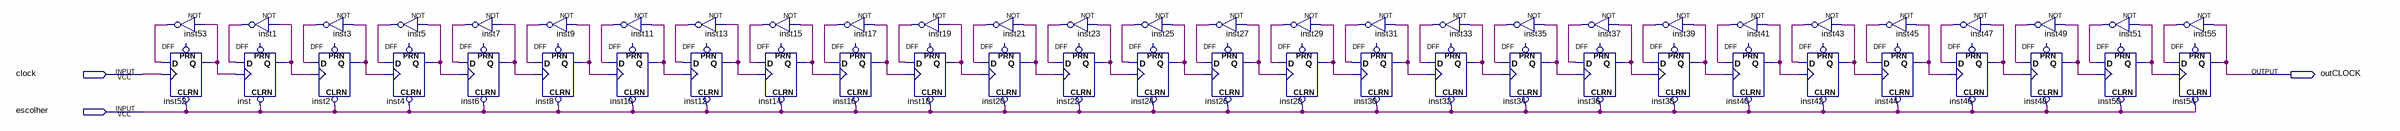
[diagram p0: schematic sheet]
// Quartus schematic divisor2.bdf as structural Verilog: 56 symbols, 3 pins
module divisor2 (
  input  clock,
  input  escolher,
  output outCLOCK
);

  wire inst1_out, inst2_q, inst3_out, inst4_q, inst5_out, inst6_q, inst7_out, inst8_q, inst9_out, inst10_q,
       inst11_out, inst12_q, inst13_out, inst14_q, inst15_out, inst16_q, inst17_out, inst18_q, inst19_out,
       inst20_q, inst21_out, inst22_q, inst23_out, inst24_q, inst25_out, inst26_q, inst27_out, inst28_q,
       inst29_out, inst30_q, inst31_out, inst32_q, inst33_out, inst34_q, inst35_out, inst36_q, inst37_out,
       inst38_q, inst39_out, inst40_q, inst41_out, inst42_q, inst43_out, inst44_q, inst45_out, inst46_q,
       inst47_out, inst48_q, inst49_out, inst50_q, inst51_out, inst52_q, inst53_out, inst55_out, inst_q;

  not inst53 (inst53_out, inst52_q);
  DFF inst52 (.CLRN(escolher), .CLK(clock), .D(inst53_out), .Q(inst52_q));  // open: PRN
  not inst1 (inst1_out, inst_q);
  DFF inst (.CLRN(escolher), .CLK(inst52_q), .D(inst1_out), .Q(inst_q));  // open: PRN
  not inst3 (inst3_out, inst2_q);
  DFF inst2 (.CLRN(escolher), .CLK(inst_q), .D(inst3_out), .Q(inst2_q));  // open: PRN
  not inst5 (inst5_out, inst4_q);
  DFF inst4 (.CLRN(escolher), .CLK(inst2_q), .D(inst5_out), .Q(inst4_q));  // open: PRN
  not inst7 (inst7_out, inst6_q);
  DFF inst6 (.CLRN(escolher), .CLK(inst4_q), .D(inst7_out), .Q(inst6_q));  // open: PRN
  not inst9 (inst9_out, inst8_q);
  DFF inst8 (.CLRN(escolher), .CLK(inst6_q), .D(inst9_out), .Q(inst8_q));  // open: PRN
  not inst11 (inst11_out, inst10_q);
  DFF inst10 (.CLRN(escolher), .CLK(inst8_q), .D(inst11_out), .Q(inst10_q));  // open: PRN
  not inst13 (inst13_out, inst12_q);
  DFF inst12 (.CLRN(escolher), .CLK(inst10_q), .D(inst13_out), .Q(inst12_q));  // open: PRN
  not inst15 (inst15_out, inst14_q);
  DFF inst14 (.CLRN(escolher), .CLK(inst12_q), .D(inst15_out), .Q(inst14_q));  // open: PRN
  not inst17 (inst17_out, inst16_q);
  DFF inst16 (.CLRN(escolher), .CLK(inst14_q), .D(inst17_out), .Q(inst16_q));  // open: PRN
  not inst19 (inst19_out, inst18_q);
  DFF inst18 (.CLRN(escolher), .CLK(inst16_q), .D(inst19_out), .Q(inst18_q));  // open: PRN
  not inst21 (inst21_out, inst20_q);
  DFF inst20 (.CLRN(escolher), .CLK(inst18_q), .D(inst21_out), .Q(inst20_q));  // open: PRN
  not inst23 (inst23_out, inst22_q);
  DFF inst22 (.CLRN(escolher), .CLK(inst20_q), .D(inst23_out), .Q(inst22_q));  // open: PRN
  not inst25 (inst25_out, inst24_q);
  DFF inst24 (.CLRN(escolher), .CLK(inst22_q), .D(inst25_out), .Q(inst24_q));  // open: PRN
  not inst27 (inst27_out, inst26_q);
  DFF inst26 (.CLRN(escolher), .CLK(inst24_q), .D(inst27_out), .Q(inst26_q));  // open: PRN
  not inst29 (inst29_out, inst28_q);
  DFF inst28 (.CLRN(escolher), .CLK(inst26_q), .D(inst29_out), .Q(inst28_q));  // open: PRN
  not inst31 (inst31_out, inst30_q);
  DFF inst30 (.CLRN(escolher), .CLK(inst28_q), .D(inst31_out), .Q(inst30_q));  // open: PRN
  not inst33 (inst33_out, inst32_q);
  DFF inst32 (.CLRN(escolher), .CLK(inst30_q), .D(inst33_out), .Q(inst32_q));  // open: PRN
  not inst35 (inst35_out, inst34_q);
  DFF inst34 (.CLRN(escolher), .CLK(inst32_q), .D(inst35_out), .Q(inst34_q));  // open: PRN
  not inst37 (inst37_out, inst36_q);
  DFF inst36 (.CLRN(escolher), .CLK(inst34_q), .D(inst37_out), .Q(inst36_q));  // open: PRN
  not inst39 (inst39_out, inst38_q);
  DFF inst38 (.CLRN(escolher), .CLK(inst36_q), .D(inst39_out), .Q(inst38_q));  // open: PRN
  not inst41 (inst41_out, inst40_q);
  DFF inst40 (.CLRN(escolher), .CLK(inst38_q), .D(inst41_out), .Q(inst40_q));  // open: PRN
  not inst43 (inst43_out, inst42_q);
  DFF inst42 (.CLRN(escolher), .CLK(inst40_q), .D(inst43_out), .Q(inst42_q));  // open: PRN
  not inst45 (inst45_out, inst44_q);
  DFF inst44 (.CLRN(escolher), .CLK(inst42_q), .D(inst45_out), .Q(inst44_q));  // open: PRN
  not inst47 (inst47_out, inst46_q);
  DFF inst46 (.CLRN(escolher), .CLK(inst44_q), .D(inst47_out), .Q(inst46_q));  // open: PRN
  not inst49 (inst49_out, inst48_q);
  DFF inst48 (.CLRN(escolher), .CLK(inst46_q), .D(inst49_out), .Q(inst48_q));  // open: PRN
  not inst51 (inst51_out, inst50_q);
  DFF inst50 (.CLRN(escolher), .CLK(inst48_q), .D(inst51_out), .Q(inst50_q));  // open: PRN
  not inst55 (inst55_out, outCLOCK);
  DFF inst54 (.CLRN(escolher), .CLK(inst50_q), .D(inst55_out), .Q(outCLOCK));  // open: PRN
endmodule
